# EAGLE design Varella_Aquisition_Module - v.2.0 (EAGLE 9.4.2)
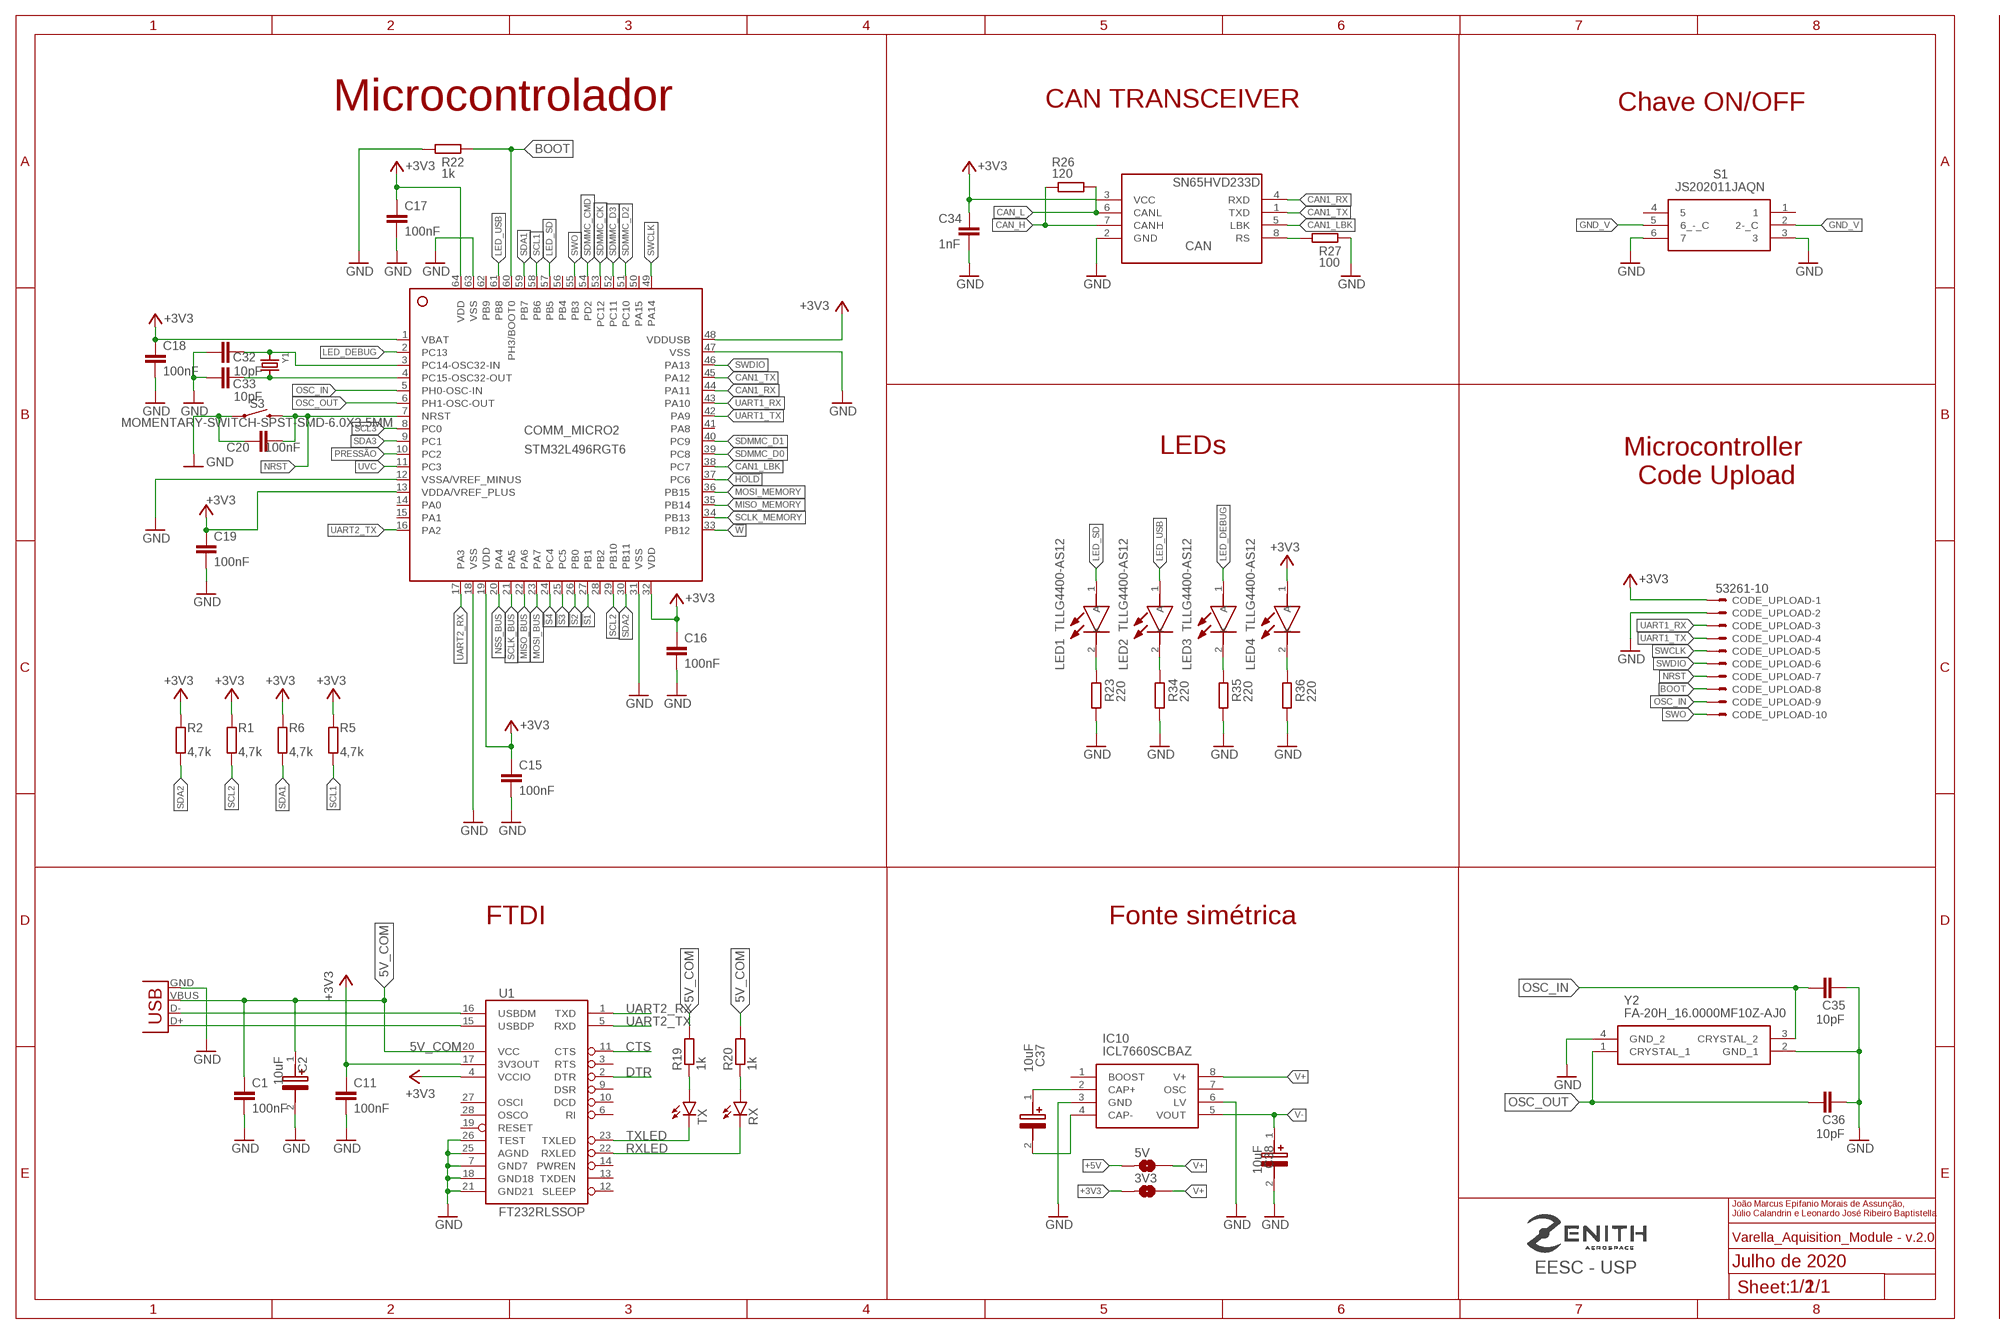
[diagram p0: schematic, sheet 1, part 1 of 2]
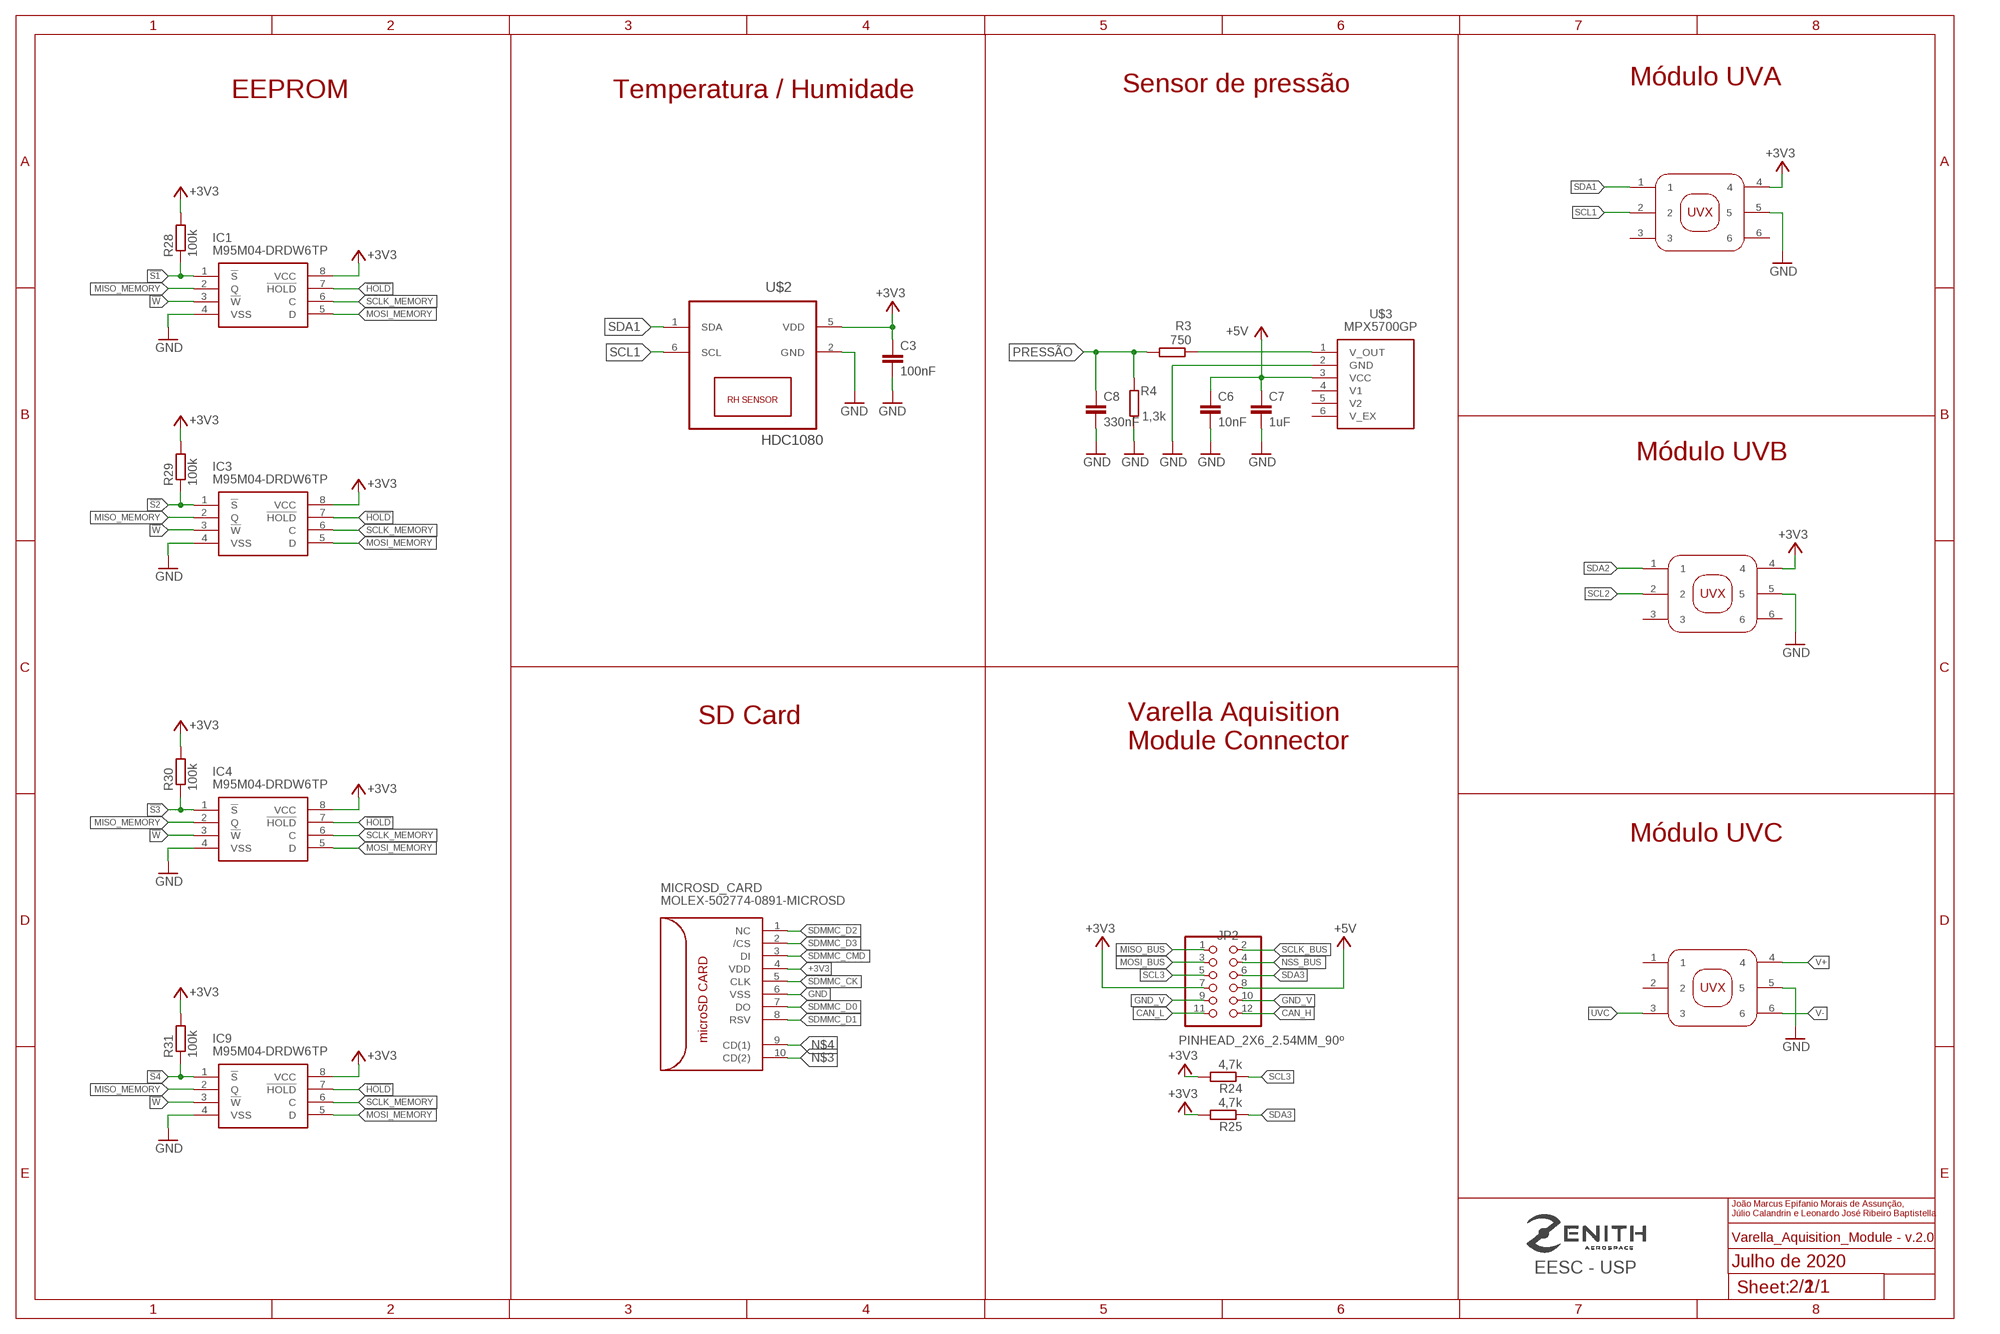
[diagram p1: schematic, sheet 1, part 2 of 2]

## Parts
3V3  SMD-JUMPER-2  [SMD-JUMPER-2]
5V  SMD-JUMPER-2  [SMD-JUMPER-2]
C1  100nF  C-EUC0805  [C0805]
C2  10uF  EEE-FN1A100R  [CAPAE430X610N]
C3  100nF  C-EUC0805  [C0805]
C6  10nF  C-EUC0805  [C0805]
C7  1uF  C-EUC0805  [C0805]
C8  330nF  C-EUC0805  [C0805]
C11  100nF  C-EUC0805  [C0805]
C15  100nF  C-EUC0805  [C0805]
C16  100nF  C-EUC0805  [C0805]
C17  100nF  C-EUC0805  [C0805]
C18  100nF  C-EUC0805  [C0805]
C19  100nF  C-EUC0805  [C0805]
C20  100nF  C-EUC0805  [C0805]
C32  10pF  C-EUC0805  [C0805]
C33  10pF  C-EUC0805  [C0805]
C34  1nF  C-EUC1206  [C1206]
C35  10pF  C-EUC0805  [C0805]
C36  10pF  C-EUC0805  [C0805]
C37  10uF  EEE-FN1A100R  [CAPAE430X610N]
C38  10uF  EEE-FN1A100R  [CAPAE430X610N]
CAN  SN65HVD233D  [SOIC8]
CODE_UPLOAD  53261-10  [53261-10]
COMM_MICRO2  STM32L496RGT6  [LQFP64_10X10]
IC1  M95M04-DRDW6TP  [SOP65P640X120-8N]
IC3  M95M04-DRDW6TP  [SOP65P640X120-8N]
IC4  M95M04-DRDW6TP  [SOP65P640X120-8N]
IC9  M95M04-DRDW6TP  [SOP65P640X120-8N]
IC10  ICL7660SCBAZ  [SOIC127P600X175-8N@1]
JP2  PINHEAD_2X6_2.54MM_90º  [PINHEAD_2X6_2.54MM_90º]
LED1  TLLG4400-AS12  [TLLG4400AS12]
LED2  TLLG4400-AS12  [TLLG4400AS12]
LED3  TLLG4400-AS12  [TLLG4400AS12]
LED4  TLLG4400-AS12  [TLLG4400AS12]
MICROSD_CARD  MOLEX-502774-0891-MICROSD  [MOLEX-502774-0891-MICROSD]
R1  4,7k  R-EU_R0805  [R0805]
R2  4,7k  R-EU_R0805  [R0805]
R3  750  R-EU_R0805  [R0805]
R4  1,3k  R-EU_R0805  [R0805]
R5  4,7k  R-EU_R0805  [R0805]
R6  4,7k  R-EU_R0805  [R0805]
R19  1k  R-EU_R0805  [R0805]
R20  1k  R-EU_R0805  [R0805]
R22  1k  R-EU_R0805  [R0805]
R23  220  R-EU_R0805  [R0805]
R24  4,7k  R-EU_R0805  [R0805]
R25  4,7k  R-EU_R0805  [R0805]
R26  120  R-EU_R1206  [R1206]
R27  100  R-EU_R0805  [R0805]
R28  100k  R-EU_R0805  [R0805]
R29  100k  R-EU_R0805  [R0805]
R30  100k  R-EU_R0805  [R0805]
R31  100k  R-EU_R0805  [R0805]
R34  220  R-EU_R0805  [R0805]
R35  220  R-EU_R0805  [R0805]
R36  220  R-EU_R0805  [R0805]
RX  LEDCHIPLED_0805  [CHIPLED_0805]
S1  JS202011JAQN  [JS202011JAQN]
S3  MOMENTARY-SWITCH-SPST-SMD-6.0X3.5MM  [TACTILE_SWITCH_SMD_6.0X3.5MM]
TX  LEDCHIPLED_0805  [CHIPLED_0805]
U1  FT232RLSSOP  [SSOP28DB]
U$2  HDC1080  [TI-S-PWSON-N6]
U$3  MPX5700GP  [MPX5700GP]
U$6  MODULO_UV  [MODULO_UV]
U$7  MODULO_UV  [MODULO_UV]
U$8  MODULO_UV  [MODULO_UV]
X2  USB-SMD-NS  [USB-MINIB-NOSTOP]
Y1  CRYSTAL8X3.8SMT  [CRYSTAL_8X3.8]
Y2  FA-20H_16.0000MF10Z-AJ0  [FA20H160000MF12ZAC3]

## Nets
5V_COM: C1.1 C2.1(+) R19.2 R20.2 U1.20(VCC) X2.VBUS
!HOLD: COMM_MICRO2.37(PC6) IC1.7(!HOLD) IC3.7(!HOLD) IC4.7(!HOLD) IC9.7(!HOLD)
!S1: COMM_MICRO2.27(PB1) IC1.1(!S) R28.1
!S2: COMM_MICRO2.26(PB0) IC3.1(!S) R29.1
!S3: COMM_MICRO2.25(PC5) IC4.1(!S) R30.1
!S4: COMM_MICRO2.24(PC4) IC9.1(!S) R31.1
!W: COMM_MICRO2.33(PB12) IC1.3(!W) IC3.3(!W) IC4.3(!W) IC9.3(!W)
+3V3: 3V3.2 C3.1 C11.1 C15.1 C16.1 C17.1 C18.1 C19.1 C34.1 CAN.3(VCC) CODE_UPLOAD.1 COMM_MICRO2.1(VBAT) COMM_MICRO2.13(VDDA/VREF_PLUS) COMM_MICRO2.19(VDD) COMM_MICRO2.32(VDD) COMM_MICRO2.48(VDDUSB) COMM_MICRO2.64(VDD) IC1.8(VCC) IC3.8(VCC) IC4.8(VCC) IC9.8(VCC) JP2.7 LED4.1(A) MICROSD_CARD.4(VDD) R1.2 R2.2 R5.2 R6.2 R24.2 R25.2 R28.2 R29.2 R30.2 R31.2 U1.4(VCCIO) U1.17(3V3OUT) U$2.5(VDD) U$6.4 U$7.4
+5V: 5V.2 C6.1 C7.1 JP2.8 U$3.3(VCC)
BOOT: CODE_UPLOAD.8 COMM_MICRO2.60(PH3/BOOT0) R22.1
CAN1_LBK: CAN.5(LBK) COMM_MICRO2.38(PC7)
CAN1_RX: CAN.4(RXD) COMM_MICRO2.44(PA11)
CAN1_TX: CAN.1(TXD) COMM_MICRO2.45(PA12)
CAN_H: CAN.7(CANH) JP2.12 R26.1
CAN_L: CAN.6(CANL) JP2.11 R26.2
CRYSTAL1: C32.2 COMM_MICRO2.3(PC14-OSC32-IN) Y1.P$1
CTS: U1.11(CTS)
DTR: U1.2(DTR)
GND [power]: C1.2 C2.2(-) C3.2 C6.2 C7.2 C8.2 C11.2 C15.2 C16.2 C17.2 C18.2 C19.2 C20.1 C32.1 C33.1 C34.2 C35.2 C36.2 C38.2(-) CAN.2(GND) CODE_UPLOAD.2 COMM_MICRO2.12(VSSA/VREF_MINUS) COMM_MICRO2.18(VSS) COMM_MICRO2.31(VSS) COMM_MICRO2.47(VSS) COMM_MICRO2.63(VSS) IC1.4(VSS) IC3.4(VSS) IC4.4(VSS) IC9.4(VSS) IC10.3(GND) IC10.6(LV) MICROSD_CARD.6(VSS) R4.2 R22.2 R23.1 R27.1 R34.1 R35.1 R36.1 S1.3 S1.6 S3.1 U1.7(GND7) U1.18(GND18) U1.21(GND21) U1.25(AGND) U1.26(TEST) U$2.2(GND) U$6.5 U$7.5 U$8.5 X2.GND Y2.2(GND_1) Y2.4(GND_2)
GND_V: JP2.9 JP2.10 S1.2(2-_C) S1.5(6_-_C)
LED_DEBUG: COMM_MICRO2.2(PC13) LED3.1(A)
LED_SD: COMM_MICRO2.57(PB5) LED1.1(A)
LED_USB: COMM_MICRO2.61(PB8) LED2.1(A)
MISO_BUS: COMM_MICRO2.22(PA6) JP2.1
MISO_MEMORY: COMM_MICRO2.35(PB14) IC1.2(Q) IC3.2(Q) IC4.2(Q) IC9.2(Q)
MOSI_BUS: COMM_MICRO2.23(PA7) JP2.3
MOSI_MEMORY: COMM_MICRO2.36(PB15) IC1.5(D) IC3.5(D) IC4.5(D) IC9.5(D)
N$3: MICROSD_CARD.10(CD(2))
N$4: MICROSD_CARD.9(CD(1))
N$5: U$3.2(GND)
N$6: R3.1 U$3.1(V_OUT)
N$10: C33.2 COMM_MICRO2.4(PC15-OSC32-OUT) Y1.P$4
N$11: CAN.8(RS) R27.2
N$12: C37.1(+) IC10.2(CAP+)
N$13: C37.2(-) IC10.4(CAP-)
N$16: LED1.2(K) R23.2
N$17: LED2.2(K) R34.2
N$19: LED3.2(K) R35.2
N$20: LED4.2(K) R36.2
NRST: C20.2 CODE_UPLOAD.7 COMM_MICRO2.7(NRST) S3.2
NSS_BUS: COMM_MICRO2.20(PA4) JP2.4
OSC_IN: C35.1 CODE_UPLOAD.9 COMM_MICRO2.5(PH0-OSC-IN) Y2.3(CRYSTAL_2)
OSC_OUT: C36.1 COMM_MICRO2.6(PH1-OSC-OUT) Y2.1(CRYSTAL_1)
PRESSÃO: C8.1 COMM_MICRO2.10(PC2) R3.2 R4.1
RXL: R20.1 RX.A
RXLED: RX.C U1.22(RXLED)
SCL1: COMM_MICRO2.58(PB6) R5.1 U$2.6(SCL) U$6.2
SCL2: COMM_MICRO2.29(PB10) R1.1 U$7.2
SCL3: COMM_MICRO2.8(PC0) JP2.5 R24.1
SCLK_BUS: COMM_MICRO2.21(PA5) JP2.2
SCLK_MEMORY: COMM_MICRO2.34(PB13) IC1.6(C) IC3.6(C) IC4.6(C) IC9.6(C)
SDA1: COMM_MICRO2.59(PB7) R6.1 U$2.1(SDA) U$6.1
SDA2: COMM_MICRO2.30(PB11) R2.1 U$7.1
SDA3: COMM_MICRO2.9(PC1) JP2.6 R25.1
SDMMC_CK: COMM_MICRO2.53(PC12) MICROSD_CARD.5(CLK)
SDMMC_CMD: COMM_MICRO2.54(PD2) MICROSD_CARD.3(DI)
SDMMC_D0: COMM_MICRO2.39(PC8) MICROSD_CARD.7(DO)
SDMMC_D1: COMM_MICRO2.40(PC9) MICROSD_CARD.8(RSV)
SDMMC_D2: COMM_MICRO2.51(PC10) MICROSD_CARD.1(NC)
SDMMC_D3: COMM_MICRO2.52(PC11) MICROSD_CARD.2(/CS)
SWCLK: CODE_UPLOAD.5 COMM_MICRO2.49(PA14)
SWDIO: CODE_UPLOAD.6 COMM_MICRO2.46(PA13)
SWO: CODE_UPLOAD.10 COMM_MICRO2.55(PB3)
TXL: R19.1 TX.A
TXLED: TX.C U1.23(TXLED)
UART1_RX: CODE_UPLOAD.3 COMM_MICRO2.43(PA10)
UART1_TX: CODE_UPLOAD.4 COMM_MICRO2.42(PA9)
UART2_RX: COMM_MICRO2.17(PA3) U1.1(TXD)
UART2_TX: COMM_MICRO2.16(PA2) U1.5(RXD)
USB_D+2: U1.15(USBDP) X2.D+
USB_D-2: U1.16(USBDM) X2.D-
UVC: COMM_MICRO2.11(PC3) U$8.3
V+: 3V3.1 5V.1 IC10.8(V+) U$8.4
V-: C38.1(+) IC10.5(VOUT) U$8.6
Unconnected: COMM_MICRO2.14(PA0) COMM_MICRO2.15(PA1) COMM_MICRO2.28(PB2) COMM_MICRO2.41(PA8) COMM_MICRO2.50(PA15) COMM_MICRO2.56(PB4) COMM_MICRO2.62(PB9) IC10.1(BOOST) IC10.7(OSC) S1.1 S1.4 U1.3(RTS) U1.6(RI) U1.9(DSR) U1.10(DCD) U1.12(SLEEP) U1.13(TXDEN) U1.14(PWREN) U1.19(RESET) U1.27(OSCI) U1.28(OSCO) U$3.4(V1) U$3.5(V2) U$3.6(V_EX) U$6.3 U$6.6 U$7.3 U$7.6 U$8.1 U$8.2

## Notes on the sheet
- Sensor de pressão | Módulo UVA
- CAN TRANSCEIVER | EEPROM | Temperatura / Humidade
- Microcontrolador | Chave ON/OFF
- LEDs
- Microcontroller
   Code Upload
- Módulo UVB
- SD Card
- Varella Aquisition 
  Module Connector
- Módulo UVC
- FTDI | Fonte simétrica
- João Marcus Epifanio Morais de Assunção,
  Júlio Calandrin e Leonardo José Ribeiro Baptistella
- João Marcus Epifanio Morais de Assunção,
  Júlio Calandrin e Leonardo José Ribeiro Baptistella
- EESC - USP | Julho de 2020 | EESC - USP | Julho de 2020
- 1/2 | 2/2
- C:/Users/marcu/Desktop/Ensino Superior/Graduação - Eng Elétrica/Zenith/zenith-v2.bmp | C:/Users/marcu/Desktop/Ensino Superior/Graduação - Eng Elétrica/Zenith/zenith-v2.bmp

## Library data of the parts
3V3 5V = FaBo-PIN:SMD-JUMPER-2
C1 C3 C6-C8 C11 C15-C20 C32-C36 = rcl:C-EU: CAPACITOR, European symbol; SPICEPREFIX: C
C2 C37 C38 = SamacSys_Parts:EEE-FN1A100R: Cap Aluminum Lytic 10uF 10V 20% (4 X 5.8mm) SMD 1.35 Ohm 90mA 2000h 105C Automotive T/R Source: Datasheet <https://b2b-api.panasonic.eu/file_stream/pids/fileversion/9127>; DESCRIPTION: Cap Aluminum Lytic 10uF 10V 20% (4 X 5.8mm) SMD 1.35 Ohm 90mA 2000h 105C Automotive T/R; HEIGHT: 6.1mm; MANUFACTURER_NAME: Panasonic; MANUFACTURER_PART_NUMBER: EEE-FN1A100R; MOUSER_PART_NUMBER: 667-EEE-FN1A100R; MOUSER_PRICE-STOCK: https://www.mouser.co.uk/ProductDetail/Panasonic/EEE-FN1A100R?qs=OlC7AqGiEDnwyj8%252BXXw94g%3D%3D
CAN = SN65HVD233D:SN65HVD233D; AVAILABILITY: Unavailable; DESCRIPTION: 3.3V CAN Transceiver with Standby Mode, Loop-back 8-SOIC -40 to 125; MF: Texas Instruments; MP: SN65HVD233D; PACKAGE: SOIC-8 Texas Instruments; PRICE: None
CODE_UPLOAD = con-molex:53?-10: CONNECTOR wire to board 1.25 mm (.049 inch) pitch header; MF: MOLEX; OC_FARNELL: unknown; OC_NEWARK: unknown
COMM_MICRO2 = STM32L4xxx:STM32L496R*: STM32L496RX LQFP64 Cortex M4, 80MHz, 512kB-1024kB Flash, 320kB SRAM Datasheet STM32L496XX <http://www.st.com/content/ccc/resource/technical/document/datasheet/group3/3f/73/19/d1/d4/9e/48/34/DM00284211/files/DM00284211.pdf/jcr:content/translations/en.DM00284211.pdf>; FARNELL: 2725138; FLASH: 1024kB; SRAM: 320kB
IC1 IC3 IC4 IC9 = SamacSys_Parts:M95M04-DRDW6TP: EEPROM 4-Mbit serial SPI bus EEPROM Source: Datasheet <https://componentsearchengine.com/Datasheets/1/M95M04-DRDW6TP.pdf>; DESCRIPTION: EEPROM 4-Mbit serial SPI bus EEPROM; HEIGHT: 1.2mm; MANUFACTURER_NAME: STMicroelectronics; MANUFACTURER_PART_NUMBER: M95M04-DRDW6TP; MOUSER_PART_NUMBER: 511-M95M04-DRDW6TP; MOUSER_PRICE-STOCK: https://www.mouser.co.uk/ProductDetail/STMicroelectronics/M95M04-DRDW6TP?qs=wnTfsH77Xs5ZmZ71YtTm4A%3D%3D
IC10 = SamacSys_Parts:ICL7660SCBAZ: CMOS VOLTAGE CONVERTER Source: Datasheet <http://componentsearchengine.com/Datasheets/3/ICL7660SCBAZ.pdf>; DESCRIPTION: CMOS VOLTAGE CONVERTER; HEIGHT: 1.75mm; MANUFACTURER_NAME: Intersil; MANUFACTURER_PART_NUMBER: ICL7660SCBAZ; MOUSER_PART_NUMBER: 968-ICL7660SCBAZ; MOUSER_PRICE-STOCK: http://www.mouser.com/Search/ProductDetail.aspx?qs=sIflSk8B27a55iJGsgXUkw%3d%3d
JP2 = Pinhead-Zenith:PINHEAD_2X6_2.54MM_90º
LED1-LED4 = SamacSys_Parts:TLLG4400-AS12: Standard LEDs - Through Hole Green; 1.2mcd; 3mm 562-575nm; 1.9V Typ Source: Datasheet <http://www.vishay.com/docs/83029/tllg440.pdf>; DESCRIPTION: Standard LEDs - Through Hole Green; 1.2mcd; 3mm 562-575nm; 1.9V Typ; HEIGHT: 6.1mm; MANUFACTURER_NAME: Vishay; MANUFACTURER_PART_NUMBER: TLLG4400-AS12; MOUSER_PART_NUMBER: 78-TLLG4400-AS12; MOUSER_PRICE-STOCK: https://www.mouser.co.uk/ProductDetail/Vishay-Semiconductors/TLLG4400-AS12?qs=ZTK%252Bjoi3Sg6xGMde4j6A1A%3D%3D
MICROSD_CARD = Ava:MOLEX-502774-0891-MICROSD; FARNELL: 2064063
R1-R6 R19 R20 R22-R31 R34-R36 = rcl:R-EU_: RESISTOR, European symbol; SPICEPREFIX: R
RX TX = led:LED: LED OSRAM: - CHIPLED LG R971, LG N971, LY N971, LG Q971, LY Q971, LO R971, LY R971 LH N974, LH R974 LS Q976, LO Q976, LY Q976 LO Q996 - Hyper CHIPLED LW Q18S LB Q993, LB Q99A, LB R99A - SideLED LS A670, LO A670, LY A670, LG A670, LP A670 LB A673, LV A673, LT A673, LW A673 LH A674 LY A675 LS A676, LA A676, LO A676, LY A676, LW A676 LS A679, LY A679, LG A679 - Hyper Micro SIDELED® LS Y876, LA Y876, LO Y876, LY Y876 LT Y87S - SmartLED LW L88C, LW L88S LB L89C, LB L89S, LG L890 LS L89K, LO L89K, LY L89K LS L896, LA L896, LO L896, LY L896 - TOPLED LS T670, LO T670, LY T670, LG T670, LP T670 LSG T670, LSP T670, LSY T670, LOP T670, LYG T670 LG T671, LOG T671, LSG T671 LB T673, LV T673, LT T673, LW T673 LH T674 LS T676, LA T676, LO T676, LY T676, LB T676, LH T676, LSB T676, LW T676 LB T67C, LV T67C, LT T67C, LS T67K, LO T67K, LY T67K, LW E67C LS E67B, LA E67B, LO E67B, LY E67B, LB E67C, LV E67C, LT E67C LW T67C LS T679, LY T679, LG T679 LS T770, LO T770, LY T770, LG T770, LP T770 LB T773, LV T773, LT T773, LW T773 LH T774 LS E675, LA E675, LY E675, LS T675 LS T776, LA T776, LO T776, LY T776, LB T776 LHGB T686 LT T68C, LB T68C - Hyper Mini TOPLED® LB M676 - Mini TOPLED Santana® LG M470 LS M47K, LO M47K, LY M47K Source: http://www.osram.convergy.de LUXEON: - LUMILED® LXK2-PW12-R00, LXK2-PW12-S00, LXK2-PW14-U00, LXK2-PW14-V00 LXK2-PM12-R00, LXK2-PM12-S00, LXK2-PM14-U00 LXK2-PE12-Q00, LXK2-PE12-R00, LXK2-PE12-S00, LXK2-PE14-T00, LXK2-PE14-U00 LXK2-PB12-K00, LXK2-PB12-L00, LXK2-PB12-M00, LXK2-PB14-N00, LXK2-PB14-P00, LXK2-PB14-Q00 LXK2-PR12-L00, LXK2-PR12-M00, LXK2-PR14-Q00, LXK2-PR14-R00 LXK2-PD12-Q00, LXK2-PD12-R00, LXK2-PD12-S00 LXK2-PH12-R00, LXK2-PH12-S00 LXK2-PL12-P00, LXK2-PL12-Q00, LXK2-PL12-R00 Source: www.luxeon.com KINGBRIGHT: KA-3528ASYC Source: www.kingbright.com
S1 = SamacSys_Parts:JS202011JAQN: JS Series Sub-Miniature Slide Switch Source: Datasheet <https://www.ckswitches.com/media/1422/js.pdf>; DESCRIPTION: JS Series Sub-Miniature Slide Switch; HEIGHT: 3mm; MANUFACTURER_NAME: C & K COMPONENTS; MANUFACTURER_PART_NUMBER: JS202011JAQN; MOUSER_PART_NUMBER: 611-JS202011JAQN; MOUSER_PRICE-STOCK: https://www.mouser.co.uk/ProductDetail/CK/JS202011JAQN?qs=74EMXstkWMXDMLzbTlF50w%3D%3D
S3 = SparkFun-Switches:MOMENTARY-SWITCH-SPST: Momentary Switch (Pushbutton) - SPST Normally-open (NO) SPST momentary switches (buttons, pushbuttons). Variants PTH-12MM - 12mm square, through-hole Momentary Pushbutton Switch - 12mm Square <https://www.sparkfun.com/products/9190> (COM-09190) PTH-6.0MM, PTH-6.0MM-KIT - 6.0mm square, through-hole Mini Pushbutton Switch <https://www.sparkfun.com/products/97> (COM-00097) KIT package intended for soldering kit's - only one side of pads' copper is exposed. PTH-RIGHT-ANGLE-KIT - Right-angle, through-hole Right Angle Tactile Button <https://www.sparkfun.com/products/10791> - Used on SparkFun BigTime Watch Kit <https://www.sparkfun.com/products/11734> SMD-12MM - 12mm square, surface-mount Tactile Button - SMD (12mm) <https://www.sparkfun.com/products/12993> (COM-12993) Used on SparkFun PicoBoard <https://www.sparkfun.com/products/11888> SMD-4.5MM - 4.5mm Square Trackball Switch Used on SparkFun Blackberry Trackballer Breakout <https://www.sparkfun.com/products/13169> SMD-4.6MMX2.8MM - 4.60mm x 2.80mm, surface mount Used on SparkFun SAMD21 Mini Breakout <https://www.sparkfun.com/products/13664> SMD-5.2MM, SMD-5.2-REDUNDANT - 5.2mm square, surface-mount Mini Pushbutton Switch - SMD <https://www.sparkfun.com/products/8720> (COM-08720) Used on Arduino Pro Mini <https://www.sparkfun.com/products/11114> REDUNDANT package connects both switch circuits together SMD-6.0X3.5MM - 6.0 x 3.5mm, surface mount Momentary Reset Switch SMD <https://www.sparkfun.com/products/8229> (COM-08229) SMD-6.2MM-TALL - 6.2mm square, surface mount Tactile Button - SMD (6mm) <https://www.sparkfun.com/products/12992> Used on SparkFun Digital Sandbox <https://www.sparkfun.com/products/12651> SMD-RIGHT-ANGLE - Right-angle, surface mount Used on SparkFun Block for Intel® Edison - Arduino <https://www.sparkfun.com/products/13036>; PROD_ID: SWCH-00815; SF_SKU: COM-08229
U1 = SparkFun:FT232RL: USB UART FT232RL 4th Generation USB UART (USB <-> Serial) Controller. Spark Fun Electronics SKU : COM-00650
U$2 = Texas-HDC1080:HDC1080
U$3 = MPX5700:MPX5700GP
U$6-U$8 = Zenith_Breakouts:MODULO_UV
X2 = SparkFun:USB: USB Connectors USB-B-PTH is fully proven SKU : PRT-00139 USB-miniB is fully proven SKU : PRT-00587 USB-A-PCB is untested. USB-A-H is throughly reviewed, but untested. Spark Fun Electronics SKU : PRT-00437 USB-B-SMT is throughly reviewed, but untested. Needs silkscreen touching up. USB-A-S has not been used/tested USB-MB-H has not been used/tested
Y1 = microbuilder:CRYSTAL: Crystals HC49UP - Surface Mount Crystal 4.0MHz 18pF +/-30ppm Surface Mount Crystal [Digikey: 535-9857-1-ND] 12.0 MHz Surface Mount Crystal [Digikey: 535-9869-6-ND] 25.0 MHz Surface Mount Crystal [Digikey: 535-9078-1-ND] 2.5 x 2.0mm - MEMs SMT Crystal 16.0 MHz 10pF 20ppm 2.5 x 2.0mm Crystal [Digikey -40-85°C: 535-10923-1-ND] 3.2 x 2.5mm - MEMs SMT Crystal 12.0 MHz 8pF 15ppm 3.2 x 2.5mm Crystal [Digikey: -10-70°C: 644-1047-1-ND -40-125°C: 644-1128-1-ND] 16.0 MHz 8pF 15ppm 3.2 x 2.5mm Crystal [Digikey: -10-70°C: 644-1049-1-ND -40-125°C: 644-1129-2-ND] 16.0 MHz 10pF 10ppm 3.2 x 2.5mm Crystal [Digikey: 644-1100-1-ND] 27.12 MHz 18pF 30ppm 3.2 x 2.5mm Crystal [Digikey: 887-1424-1-ND] 27.12MHz 10pF 10ppm 3.2 x 2.5mm Crystal [Digikey: 887-1329-1-ND] 4.9 x 1.8mm - MEMs SMT Crystal 32.768 KHz 12.5pF 20ppm 4.9 x 1.8mm Crystal [Digikey: SE2415CT-ND] 8.0 x 3.8mm - Surface Mount Crystal 32.768kHz 12.5pF 20ppm -40°C-85°C [Digikey: 535-9166-2-ND] Cylinder 32.768KHz Cylinder Crystal (2x6mm body) [Ex. Digikey: 300-8341-2-ND]
Y2 = SamacSys_Parts:FA-20H_16.0000MF10Z-AJ0: Source: Datasheet <https://support.epson.biz/td/api/doc_check.php?dl=brief_FA-20H&lang=en>; HEIGHT: 0.55mm; MANUFACTURER_NAME: Epson Timing; MANUFACTURER_PART_NUMBER: FA-20H 16.0000MF10Z-AJ0; MOUSER_PART_NUMBER: 732-FA-20H16MF10ZAJ0; MOUSER_PRICE-STOCK: https://www.mouser.co.uk/ProductDetail/Epson-Timing/FA-20H-160000MF10Z-AJ0?qs=f9yNj16SXrIaU%252BY5GFRuIg%3D%3D

## Net classes
1 power: width 0.254 mm

## Board
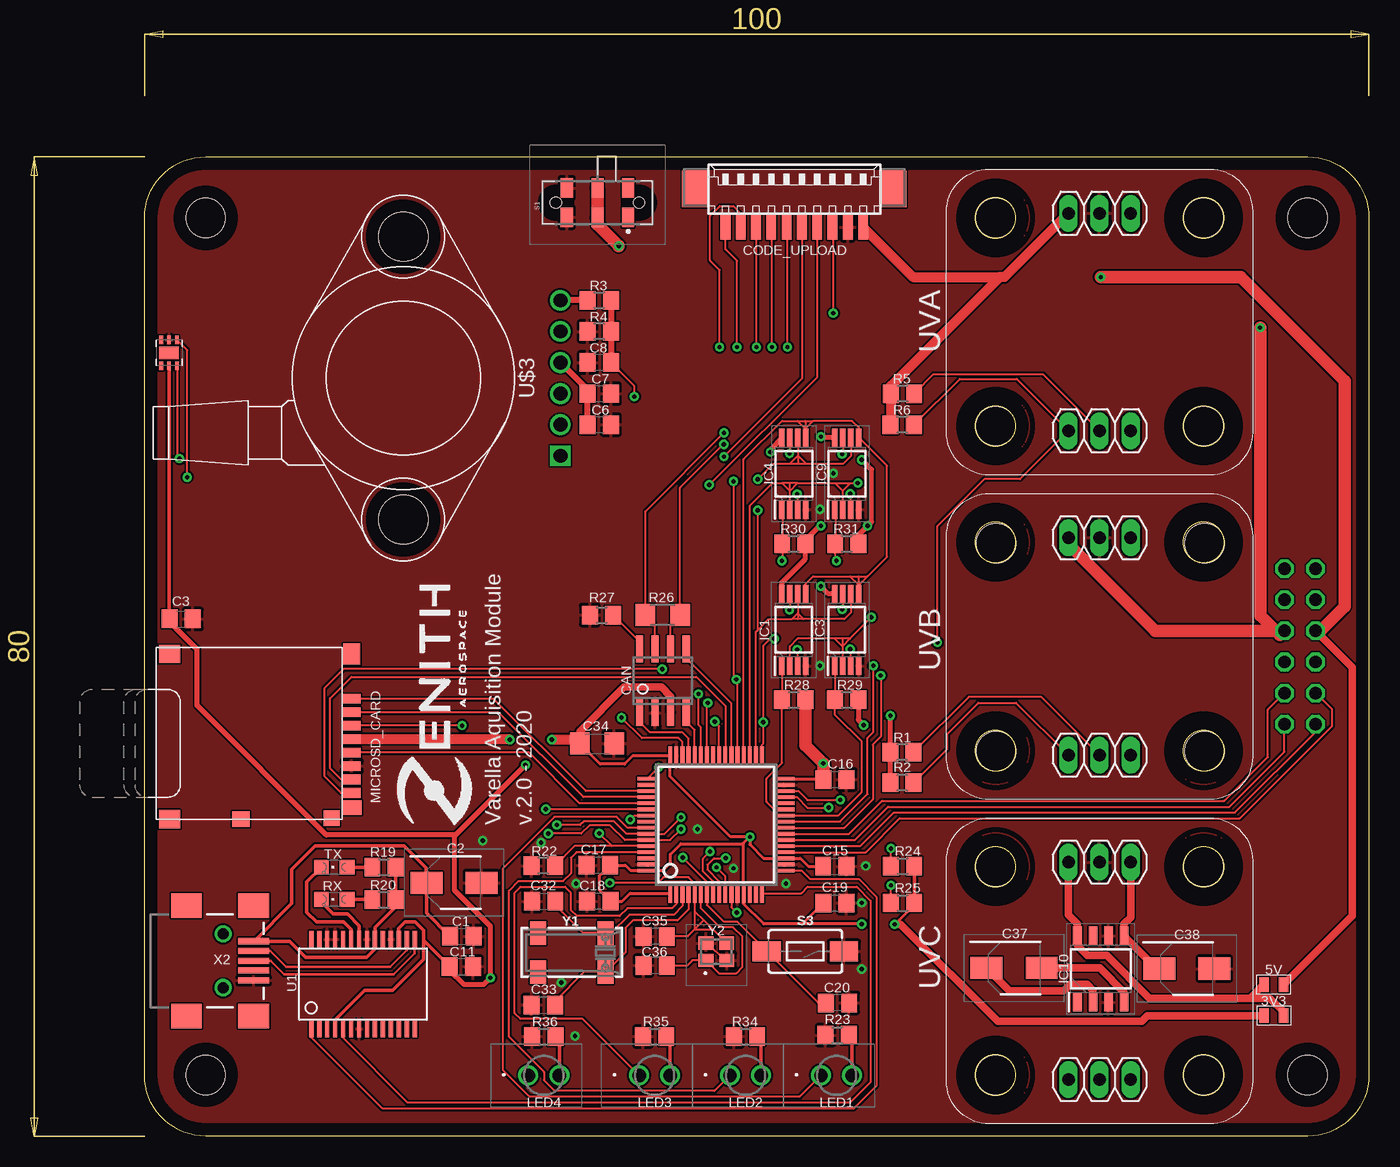
[diagram p2: board, top side]
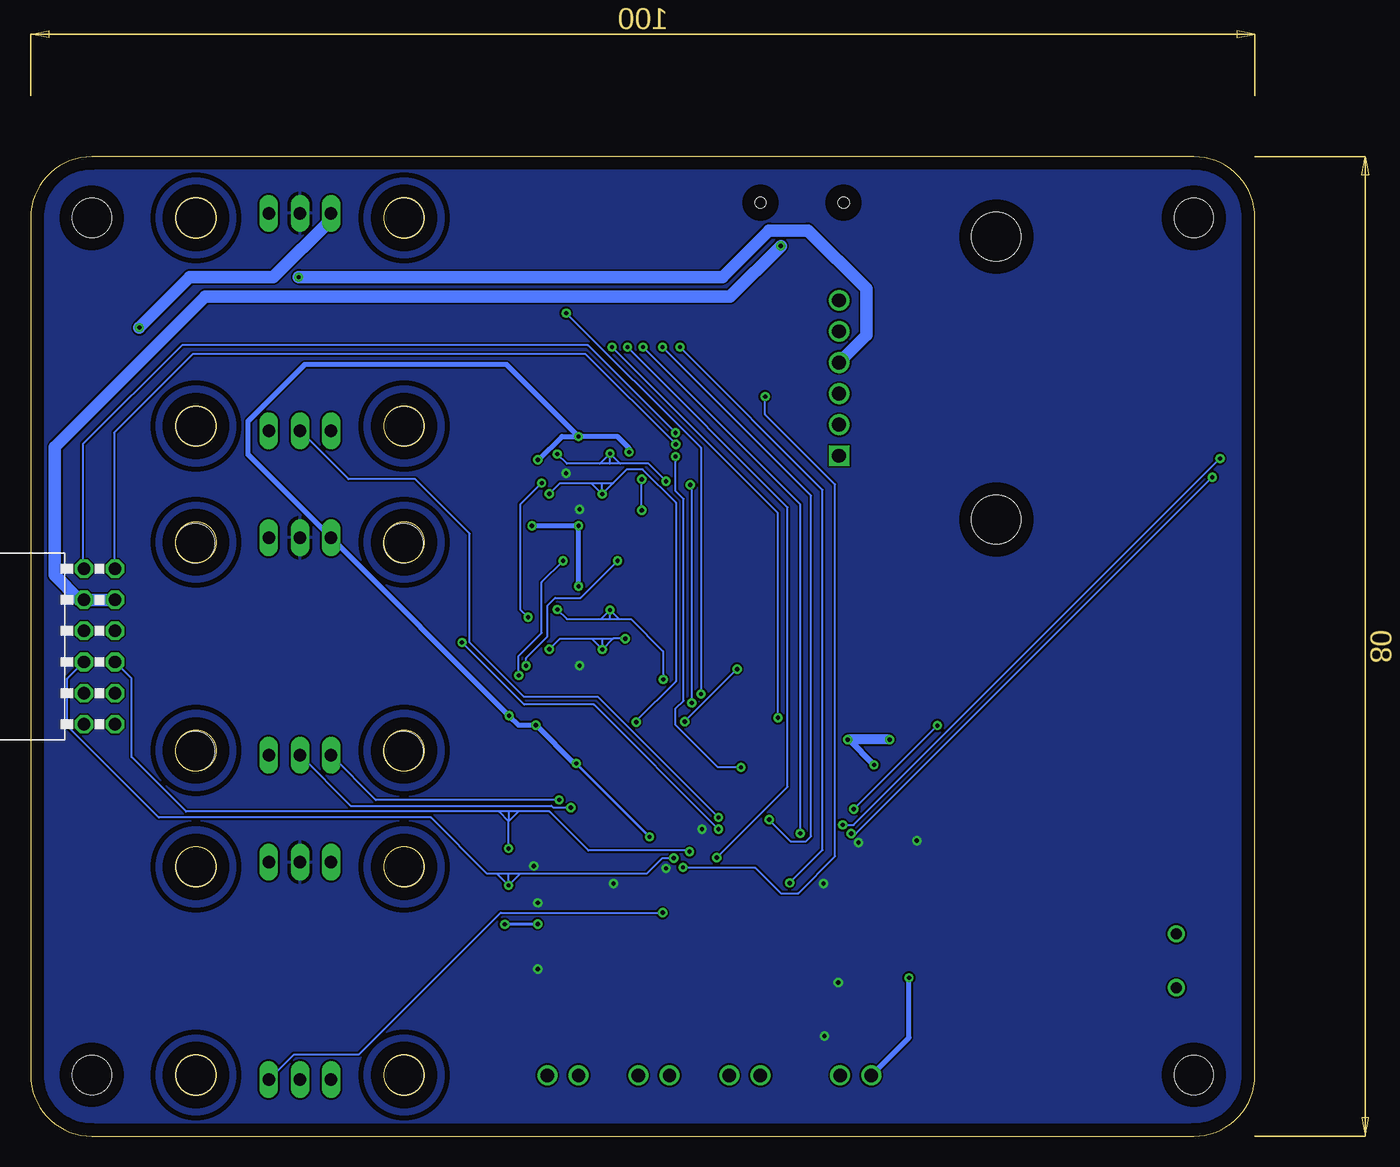
[diagram p3: board, bottom side, seen from below]

Size 100 x 80 mm. Coordinates in mm from the lower left corner, seen from the top.
Outline: 5,80 95,80 arc-90 100,75 100,5 arc-90 95,0 5,0 arc-90 0,5 0,75 arc-90 5,80
Copper layers (1*16): Top 0.035mm / dielectric 1.5mm / Bottom 0.035mm
Design rules "default": minimum track width 6mil, minimum drill 0.35mm, track to track 6mil, track to pad 6mil, pad to pad 6mil, via to via 6mil, smd to smd 6mil, copper to edge 40mil, drill to drill 6mil, minimum pad ring 10mil, minimum via ring 8mil, stop-mask expansion 4mil, vias tented up to drill 0mil, thermal gap 10mil
Holes 3.2 mm at 5,5 95,5 95,75 5,75 69.5,75 86.5,75 86.5,58 69.5,58 69.5,5 86.5,5 86.5,22 69.5,22 69.56,31.44 86.56,31.44 69.56,48.44 86.56,48.44

### Footprints (pad centres in the part's own frame; a part is rotated, then mirrored left to right if it is on the bottom)
SMD-JUMPER-2 = smd 0.8 x 1.2: 1 -0.8,0; 2 0.8,0
C0805 = smd 1.3 x 1.5: 1 -0.95,0; 2 0.95,0
CAPAE430X610N = smd 2.6 x 1.8: 1 -2.25,0; 2 2.25,0
C1206 = smd 1.6 x 1.8: 1 -1.4,0; 2 1.4,0
SOIC8 = smd 0.6 x 2.2: 1 -1.905,-2.6; 2 -0.635,-2.6; 3 0.635,-2.6; 4 1.905,-2.6; 5 1.905,2.6; 6 0.635,2.6; 7 -0.635,2.6; 8 -1.905,2.6
53261-10 = smd 0.8 x 2: 1 5.625,-2.5; 2 4.375,-2.5; 3 3.125,-2.5; 4 1.875,-2.5; 5 0.625,-2.5; 6 -0.625,-2.5; 7 -1.875,-2.5; 8 -3.125,-2.5; 9 -4.375,-2.5; 10 -5.625,-2.5 | smd 2.1 x 3: S1 8.125,0.625; S2 -8.125,0.625
LQFP64_10X10 = smd 0.3 x 1.6: 1 -3.75,-5.6; 2 -3.25,-5.6; 3 -2.75,-5.6; 4 -2.25,-5.6; 5 -1.75,-5.6; 6 -1.25,-5.6; 7 -0.75,-5.6; 8 -0.25,-5.6; 9 0.25,-5.6; 10 0.75,-5.6; 11 1.25,-5.6; 12 1.75,-5.6; 13 2.25,-5.6; 14 2.75,-5.6; 15 3.25,-5.6; 16 3.75,-5.6; 33 3.75,5.6; 34 3.25,5.6; 35 2.75,5.6; 36 2.25,5.6; 37 1.75,5.6; 38 1.25,5.6; 39 0.75,5.6; 40 0.25,5.6; 41 -0.25,5.6; 42 -0.75,5.6; 43 -1.25,5.6; 44 -1.75,5.6; 45 -2.25,5.6; 46 -2.75,5.6; 47 -3.25,5.6; 48 -3.75,5.6 | smd 1.6 x 0.3: 17 5.6,-3.75; 18 5.6,-3.25; 19 5.6,-2.75; 20 5.6,-2.25; 21 5.6,-1.75; 22 5.6,-1.25; 23 5.6,-0.75; 24 5.6,-0.25; 25 5.6,0.25; 26 5.6,0.75; 27 5.6,1.25; 28 5.6,1.75; 29 5.6,2.25; 30 5.6,2.75; 31 5.6,3.25; 32 5.6,3.75; 49 -5.6,3.75; 50 -5.6,3.25; 51 -5.6,2.75; 52 -5.6,2.25; 53 -5.6,1.75; 54 -5.6,1.25; 55 -5.6,0.75; 56 -5.6,0.25; 57 -5.6,-0.25; 58 -5.6,-0.75; 59 -5.6,-1.25; 60 -5.6,-1.75; 61 -5.6,-2.25; 62 -5.6,-2.75; 63 -5.6,-3.25; 64 -5.6,-3.75
SOP65P640X120-8N = smd 1.475 x 0.45: 1 -2.938,0.975; 2 -2.938,0.325; 3 -2.938,-0.325; 4 -2.938,-0.975; 5 2.938,-0.975; 6 2.938,-0.325; 7 2.938,0.325; 8 2.938,0.975
SOIC127P600X175-8N@1 = smd 1.525 x 0.7: 1 -2.712,1.905; 2 -2.712,0.635; 3 -2.712,-0.635; 4 -2.712,-1.905; 5 2.712,-1.905; 6 2.712,-0.635; 7 2.712,0.635; 8 2.712,1.905
PINHEAD_2X6_2.54MM_90º = drill 1.016 octagon: 1 0,0.04; 2 0,2.58; 3 2.54,0.04; 4 2.54,2.58; 5 5.08,0.04; 6 5.08,2.58; 7 7.62,0.04; 8 7.62,2.58; 9 10.16,0.04; 10 10.16,2.58; 11 12.7,0.04; 12 12.7,2.58
TLLG4400AS12 = drill 1.09 pad 1.635: 1 0,0; 2 2.54,0
MOLEX-502774-0891-MICROSD = smd 0.8 x 1.5: 1 -3.3,8.2; 2 -2.2,8.2; 3 -1.1,8.2; 4 0,8.2; 5 1.1,8.2; 6 2.2,8.2; 7 3.3,8.2; 8 4.4,8.2 | smd 1.29 x 1.3: 9 6.455,6.55 | smd 1.29 x 1.4: 10 6.54,-0.85 | smd 1.5 x 1.7: 11 6.54,-6.65; 12 -6.96,-6.65 | smd 1.7 x 1.4: 14 -6.96,8.2 | smd 1.2 x 1.6: 15 5.6,8.2
R0805 = smd 1.3 x 1.5: 1 -0.95,0; 2 0.95,0
R1206 = smd 1.6 x 1.803: 1 -1.422,0; 2 1.422,0
CHIPLED_0805 = smd 1.2 x 1.2: A 0,-1.05; C 0,1.05
JS202011JAQN = smd 1 x 1.6: 1 -2.5,2.95; 2 0,2.95; 3 2.5,2.95; 4 -2.5,0.55; 5 0,0.55; 6 2.5,0.55 | hole 0.9: -3.4,1.75; 3.4,1.75
TACTILE_SWITCH_SMD_6.0X3.5MM = smd 2.3 x 1.6: 1 -3.15,0; 2 3.15,0
SSOP28DB = smd 0.348 x 1.397: 1 -4.225,-3.656; 2 -3.575,-3.656; 3 -2.925,-3.656; 4 -2.275,-3.656; 5 -1.625,-3.656; 6 -0.975,-3.656; 7 -0.325,-3.656; 8 0.325,-3.656; 9 0.975,-3.656; 10 1.625,-3.656; 11 2.275,-3.656; 12 2.925,-3.656; 13 3.575,-3.656; 14 4.225,-3.656; 15 4.225,3.656; 16 3.575,3.656; 17 2.925,3.656; 18 2.275,3.656; 19 1.625,3.656; 20 0.975,3.656; 21 0.325,3.656; 22 -0.325,3.656; 23 -0.975,3.656; 24 -1.625,3.656; 25 -2.275,3.656; 26 -2.925,3.656; 27 -3.575,3.656; 28 -4.225,3.656
TI-S-PWSON-N6 = smd 0.3 x 0.7: 1 -0.65,-1.05; 2 0,-1.05; 3 0.65,-1.05; 4 0.65,1.05; 5 0,1.05; 6 -0.65,1.05 | smd 1.6 x 1: 7 0,0
MPX5700GP = drill 1.13 pad 1.695: 1 12.7,0; 2 10.16,0; 3 7.62,0; 4 5.08,0; 5 2.54,0 | drill 1.13 pad 1.695 square: 6 0,0 | hole 4: -5.205,12.83; 17.9,12.83
MODULO_UV = drill 1.016 long: 1 9.96,-21.38; 2 12.5,-21.38; 3 15.04,-21.38; 4 9.96,-3.62; 5 12.5,-3.62; 6 15.04,-3.62
USB-MINIB-NOSTOP = smd 2.5 x 0.5: D+ 2.5,0; D- 2.5,0.8; GND 2.5,-1.6; ID 2.5,-0.8; VBUS 2.5,1.6 | smd 2.5 x 2: G1 -3,-4.5; G2 -3,4.5; G3 2.5,4.5; G4 2.5,-4.5 | drill 0.9 pad 0.8: H1 0,2.2 | drill 0.9 pad 0.787: H2 0,-2.2
CRYSTAL_8X3.8 = smd 1.3 x 1.9: P$1 -2.75,-1.6; P$2 2.75,-1.6; P$3 2.75,1.6; P$4 -2.75,1.6
FA20H160000MF12ZAC3 = smd 1.2 x 1.1: 1 -0.85,-0.7; 2 0.85,-0.7; 3 0.85,0.7; 4 -0.85,0.7

### Placement (x,y rotation side)
3V3  92.23,9.84 180 top
5V  92.23,12.38 0 top
C1  25.91,16.33 0 top
C2  25.28,20.7 0 top
C3  3,42.25 0 top
C6  37.14,58.11 0 top
C7  37.14,60.65 0 top
C8  37.14,63.19 180 top
C11  25.88,13.85 0 top
C15  56.38,22.04 0 top
C16  56.39,29.13 0 top
C17  37.06,22.13 180 top
C18  37.1,19.18 180 top
C19  56.4,19.05 0 top
C20  56.6,10.88 180 top
C32  32.6,19.19 0 top
C33  32.57,10.71 0 top
C34  36.96,32.06 0 top
C35  41.71,16.31 180 top
C36  41.71,13.94 180 top
C37  71.02,13.74 0 top
C38  85.12,13.69 0 top
CAN  42.33,37.19 0 top
CODE_UPLOAD  53.07,76.73 0 top
COMM_MICRO2  46.69,25.44 0 top
IC1  53.03,41.36 90 top
IC3  57.36,41.36 90 top
IC4  53.04,54.1 90 top
IC9  57.37,54.1 90 top
IC10  78.1,13.66 90 top
JP2  93.07,33.65 90 bottom
LED1  55.25,4.96 0 top
LED2  47.82,4.96 0 top
LED3  40.4,4.96 0 top
LED4  31.34,4.96 0 top
MICROSD_CARD  8.72,32.43 270 top
R1  61.87,31.36 180 top
R2  61.87,28.86 180 top
R3  37.14,68.27 0 top
R4  37.14,65.73 180 top
R5  61.91,60.64 180 top
R6  61.89,58.1 180 top
R19  19.56,21.98 0 top
R20  19.56,19.32 0 top
R22  32.57,22.1 180 top
R23  56.58,8.26 0 top
R24  61.91,22.07 0 top
R25  61.91,19.05 0 top
R26  42.33,42.56 0 top
R27  37.33,42.56 0 top
R28  53.03,35.64 0 top
R29  57.36,35.64 0 top
R30  53.04,48.39 0 top
R31  57.37,48.39 0 top
R34  49.09,8.14 0 top
R35  41.67,8.14 0 top
R36  32.61,8.14 0 top
RX  15.5,19.34 90 top
S1  37,78 180 top
S3  53.97,15.09 180 top
TX  15.5,21.97 90 top
U1  17.85,12.43 0 top
U$2  2.01,63.98 180 top
U$3  33.97,55.57 90 top
U$6  65.5,79 0 top
U$7  65.5,52.5 0 top
U$8  65.5,26 0 top
X2  6.42,14.33 0 top
Y1  34.9,15 180 top
Y2  46.71,15.06 0 top

### Tracks (layer width: path | path; a pad name or v marks a point on that pad's centre or on a via)
5V_COM
  Top 0.305: R19.2 R20.2 20.52,18.75 18.82,17.06 U1.20 18.82,15.3 18.14,14.62 13.15,14.62 11.84,15.93 X2.VBUS 8.94,15.93 12.01,19 12.01,21.8 13.92,23.71 21.21,23.71 23.02,21.9 23.02,20.71 C2.1 23.03,18.23 24.93,16.33 C1.1
!HOLD  (via drill 0.35)
  Top 0.152: COMM_MICRO2.37 48.44,37.2 v48.33,37.31 48.1,37.54 v48.1,53.5 | 52.7,44.77 IC1.7 52.7,42.97 v52.67,42.97 | IC4.7 52.71,55.79 v52.67,55.75 | IC9.7 57.04,55.77 v56.99,55.72 | IC3.7 57.03,43.06 v56.99,43.02
  Bottom 0.152: v56.99,55.72 56.2,54.93 53.5,54.93 | 51.85,54.93 52.7,54.93 | 52.7,54.93 53.5,54.93 | v52.67,55.75 51.85,54.93 | v52.67,55.75 53.5,54.93 | v52.67,55.75 52.7,55.72 52.7,54.93 | v52.67,42.97 51.93,42.23 | 51.93,42.23 50.96,42.23 48.33,39.6 v48.33,37.31 | v56.99,43.02 56.2,42.23 53.42,42.23 | 53.42,42.23 52.7,42.23 | 52.7,42.23 51.93,42.23 | v52.67,42.97 53.42,42.23 | v52.67,42.97 52.7,42.94 52.7,42.23 | v48.1,53.5 49.53,54.93 51.85,54.93
!S1
  Top 0.152: IC1.1 52.08,38.39 R28.1 52.08,30.49 50.8,29.21 50.8,27.3 51.41,26.69 COMM_MICRO2.27
!S2
  Top 0.152: IC3.1 56.41,38.39 R29.1 56.41,34.4 58.58,32.23 58.58,28.1 56.67,26.19 COMM_MICRO2.26
!S3  (via drill 0.35)
  Top 0.152: IC4.1 52.09,51.14 R30.1 52.09,47.01 v52.07,46.99 | COMM_MICRO2.25 56.81,25.69 59.06,27.94 59.06,32.53 59.53,33 v59.53,38.42
  Bottom 0.152: v59.53,38.42 59.53,39.05 57.78,40.8 57.78,43.34 57.15,43.97 55.09,43.97 v52.07,46.99
!S4  (via drill 0.35)
  Top 0.152: IC9.1 56.42,51.14 R31.1 56.42,47.09 v56.52,46.99 | COMM_MICRO2.24 57.15,25.19 59.48,27.52 59.48,31.98 60.14,32.64 v60.14,37.62
  Bottom 0.152: v60.14,37.62 60.17,37.65 60.17,39.21 58.26,41.12 58.26,45.24 v56.52,46.99
!W  (via drill 0.35)
  Top 0.152: 53.35,51.17 IC4.3 53.36,52.41 v53.32,52.45 | IC9.3 57.69,52.42 v57.65,52.47 | IC1.3 53.35,39.71 v53.31,39.76 | IC3.3 57.68,39.72 v57.64,39.77 | v51.44,40.64 51.12,40.64 50.54,40.07 v50.54,33.81 50.54,32.07 50.44,31.96 COMM_MICRO2.33
  Bottom 0.152: v53.32,52.45 52.42,53.34 | v53.32,52.45 54.21,53.34 | v57.65,52.47 56.77,53.34 54.21,53.34 | 54.21,53.34 53.34,53.34 | 53.34,53.34 52.42,53.34 | v53.32,52.45 53.32,53.32 53.34,53.34 | 52.42,40.64 v53.31,39.76 | v57.64,39.77 56.77,40.64 54.19,40.64 | 54.19,40.64 53.34,40.64 53.31,40.61 | v53.31,39.76 54.19,40.64 | v53.31,39.76 53.31,40.61 | 53.31,40.61 53.28,40.64 52.42,40.64 | v51.44,40.64 52.42,40.64 | v50.54,33.81 50.54,33.91 47.31,37.15 47.31,51.75 50.01,54.45 51.31,54.45 52.42,53.34
+3V3  (via drill 0.35)
  Top 0.152: 55.32,22.04 C15.1 | 55.37,29.19 C16.1 | 35.56,31.66 C34.1 | COMM_MICRO2.64 41.6,21.69
  Top 0.254: COMM_MICRO2.32 55.37,29.19 | 55.32,22.04 54.21,22.04 53.56,22.69 COMM_MICRO2.19 50.57,22.69 49.45,23.81 v49.45,24.45 | COMM_MICRO2.1 39.66,19.84 39.01,19.18 C18.1 37.15,20.09 37.15,21.27 C17.1 39.28,22.13 39.71,21.69 COMM_MICRO2.64 42.33,21.69 42.94,22.3 42.94,23.02 43.81,23.89 48.9,23.89 48.94,23.93 | 48.94,23.93 COMM_MICRO2.13 48.94,18.98 50.59,17.33 53.73,17.33 | 48.94,23.93 v49.45,24.45 | v49.45,24.45 47.86,24.45 42.94,29.37 COMM_MICRO2.48 39.85,31.04 39.21,30.4 37.22,30.4 C34.1 | v58.58,17.33 53.73,17.33 | 62.86,18.89 v61.28,17.31 | C19.1 53.73,17.33
  Top 0.305: U1.17 20.77,16.99 21.29,17.5 22.11,17.5 22.8,16.81 22.8,15.92 | 22.8,15.92 22.8,14.46 20.26,11.92 17.98,11.92 15.57,9.52 U1.4 | C11.1 22.86,15.92 22.8,15.92 | U$2.5 2.01,42.29 C3.1 | 62.86,18.89 R25.2 R24.2 | v61.28,17.3 v61.28,17.31
  Top 0.406: IC9.8 55.35,57.04 v55.24,57.15 | IC4.8 51.12,56.1 v51.12,55.88 | v55.24,49.85 55.13,49.85 53.99,48.7 R30.2 53.98,48.4 53.98,47.15 52.05,45.23 IC1.8 | R31.2 58.32,48.7 58.26,48.65 58.26,49.05 v59.05,49.85 59.37,50.16 59.37,54.45 v58.58,55.24 | IC3.8 55.88,44.29 v55.24,44.93 | R29.2 58.31,34.01 v58.74,33.58 | C11.1 24.93,13.56 26.11,12.38 27.7,12.38 v28.26,12.94 28.26,17.14 25.32,20.08 25.32,24.53 | v31.11,30.32 25.32,24.53 | 25.32,24.53 25.32,24.61 14.84,24.61 4.29,35.16 4.29,39.77 2.01,42.05 2.01,42.29 | R2.2 R1.2 v60.91,34.34 v60.92,34.34
  Top 0.61: CAN.3 42.97,35.93 42.21,36.69 39.18,36.69 35.56,33.06 C34.1 | 3V3.2 81.92,9.84 81.44,9.37 69.69,9.37 61.76,17.3 v61.28,17.3
  Top 0.813: CODE_UPLOAD.1 62.76,70.17 69.85,70.17 | MICROSD_CARD.4 29.8,32.43 v29.84,32.38 | v33.26,32.38 35.23,32.38 C34.1 | 69.85,70.17 60.96,61.28 R5.2 60.96,58.13 R6.2 | U$6.4 70.25,70.17 69.85,70.17
  Top 1.016: v91.12,66.04 91.12,42.55 92.73,40.93 JP2.7 82.56,41.27 75.46,48.37 U$7.4 | R28.2 53.98,31.91 v55.44,30.45 C16.1
  Bottom 0.254: v55.44,30.45 v49.45,24.46 v49.45,24.45 | 58.61,17.3 v61.28,17.3
  Bottom 0.305: v58.58,17.33 58.61,17.3
  Bottom 0.406: v51.12,55.88 51.12,56.2 52.07,57.15 v55.24,57.15 | v55.24,57.15 61.12,63.02 77.63,63.02 82.23,58.42 82.23,55.65 U$7.4 v60.92,34.34 60.16,33.58 v58.74,33.58 55.61,30.45 v55.44,30.45 | v59.05,49.85 v55.24,49.85 v55.24,44.93 | v58.58,55.24 58.51,55.24 56.6,57.15 v55.24,57.15 | LED4.1 28.26,8.05 v28.26,12.94
  Bottom 0.508: v31.11,30.32 33.18,32.38 v33.26,32.38
  Bottom 0.813: v29.84,32.38 v33.26,32.38
  Bottom 1.016: v91.12,66.04 87,70.17 80.17,70.17 75.46,74.88 U$6.4
+5V  (via drill 0.35)
  Top 0.508: 36.19,60.34 C7.1 | C7.1 36.19,60.97 U$3.3 | C6.1 C7.1
  Top 0.61: JP2.8 98.63,38.29 98.64,38.26 98.64,17.99 5V.2
  Top 1.016: JP2.8 96.04,41.27 98.03,43.28 98.03,61.67 89.53,70.17 v78.11,70.17
  Bottom 1.016: U$3.3 31.75,65.41 31.75,69.22 36.51,73.98 39.69,73.98 43.5,70.17 v78.11,70.17
BOOT  (via drill 0.35)
  Top 0.152: COMM_MICRO2.60 38.17,23.69 | 38.17,23.69 35.11,23.69 R22.1 33.52,22.14 | v37.14,24.73 38.17,23.69 | v49.98,64.45 49.98,74.2 CODE_UPLOAD.8
  Bottom 0.152: v37.14,24.73 37.14,51.6 v49.98,64.45
CAN1_LBK
  Top 0.152: COMM_MICRO2.38 47.94,35.33 44.21,39.06 44.21,39.76 CAN.5
CAN1_RX
  Top 0.152: 44.94,31.84 COMM_MICRO2.44 | 44.94,31.83 COMM_MICRO2.44 | CAN.4 44.24,33.88 44.94,33.18 COMM_MICRO2.44
CAN1_TX
  Top 0.152: CAN.1 40.43,33.85 41.26,33.02 43.89,33.02 44.44,32.47 COMM_MICRO2.45
CAN_H  (via drill 0.35)
  Top 0.152: R26.1 41.7,41.78 CAN.7 | R26.1 41.07,42.56 | R26.1 40.91,51.03 v47.33,57.45
  Bottom 0.152: v47.33,57.45 54.49,64.61 87.63,64.61 95.73,56.52 95.73,46.27 JP2.12
CAN_L  (via drill 0.35)
  Top 0.152: R26.2 42.97,41.78 CAN.6 | R26.2 43.82,42.56 | R26.2 43.76,52.96 v47.31,56.52
  Bottom 0.152: v47.31,56.52 54.69,63.9 86.76,63.9 93.19,57.47 93.19,46.27 JP2.11
CRYSTAL1
  Top 0.152: 43.94,19.07 COMM_MICRO2.3 43.94,18.79 43.23,18.09 39.61,18.09 38.12,16.6 Y1.P$1 35.83,16.6 33.55,18.87 C32.2
GND  (via drill 0.35)
  Top 0.152: 47.4,14.36 46,15.76 Y2.4
  Top 0.254: Y2.2 47.4,14.36
  other vias: 32.38,23.97 35.24,20.64 27.62,24.13 48.1,21.88 35.16,8.18 34.05,12.54 55.17,38.42 55.17,51.2 52.39,20.64 56.28,54.13 45.16,25.08 58.58,19.05 58.9,22.07 58.58,13.65
  pour Top: 95,0 5,0 arc-90 0,5 0,75 arc-90 5,80 95,80 arc-90 100.32,74.68 100.32,5.32 arc-90
  pour Bottom: 95,0 5,0 arc-90 0,5 0,75 arc-90 5,80 95,80 arc-90 100.32,74.68 100.32,5.32 arc-90
GND_V  (via drill 0.35)
  Top 1.016: S1.5 S1.2 37,74.47 38.73,72.73 v38.73,72.71
  Bottom 1.016: v38.73,72.71 42.86,68.58 85.72,68.58 98.03,56.28 98.03,45.82 96.04,43.81 JP2.10 JP2.9
LED_DEBUG
  Top 0.152: COMM_MICRO2.2 43.44,18.96 43.09,18.62 39.44,18.62 38.8,17.98 35.31,17.98 34.84,18.46 34.84,19.89 34.36,20.36 30.71,20.36 30.23,19.89 30.23,10.04 30.71,9.57 35.79,9.57 LED3.1
LED_SD
  Top 0.152: LED1.1 53.51,3.22 31.46,3.22 29.28,5.4 29.28,21.87 33.49,26.08 38.57,26.08 39.45,25.19 COMM_MICRO2.57
LED_USB
  Top 0.152: COMM_MICRO2.61 35.28,23.19 34.84,22.74 34.84,21.47 34.2,20.84 30.55,20.84 29.76,20.05 29.76,8.12 32.62,5.26 32.62,4.57 33.5,3.69 46.55,3.69 LED2.1
MISO_BUS
  Top 0.152: COMM_MICRO2.22 58.01,24.19 60.72,26.91 88.62,26.91 93.11,31.4 JP2.1
MISO_MEMORY  (via drill 0.35)
  Top 0.152: IC9.2 57.04,52.68 | 52.07,53.34 52.71,52.7 | IC4.2 52.71,52.7 | 52.71,52.7 53.34,53.33 | 53.34,53.33 53.34,53.34 56.38,53.34 | 56.38,53.34 57.04,52.68 | 53.34,53.33 53.33,53.34 52.7,53.34 | 52.7,53.34 52.07,53.34 | 52.07,53.34 51.28,53.34 49.44,51.5 COMM_MICRO2.35 | 52.71,52.7 52.71,53.33 52.7,53.34 | IC3.2 57.03,39.96 | 56.36,40.64 53.34,40.64 52.7,40.01 IC1.2 | 57.03,39.96 56.36,40.64 | 57.04,52.68 57.04,52.72 57.66,53.34 | 56.38,53.34 57.66,53.34 | 57.66,53.34 v58.26,53.34 | 57.63,40.64 56.99,40.64 | 56.99,40.64 56.36,40.64 | 57.03,39.96 57.03,40.05 | 57.03,40.05 57.63,40.64 | 57.63,40.64 v59.37,42.39 | 57.03,40.05 57.03,40.6 56.99,40.64
  Bottom 0.152: v58.26,53.34 60.01,51.59 60.01,43.02 v59.37,42.39
MOSI_BUS
  Top 0.152: COMM_MICRO2.23 57.55,24.69 60.25,27.38 88.19,27.38 91.76,30.96 91.76,34.84 JP2.3
MOSI_MEMORY
  Top 0.152: IC4.5 54.01,57.75 53.34,58.42 | 53.34,58.42 52.07,58.42 48.94,55.29 COMM_MICRO2.36 | IC4.5 54.01,57.82 54.61,58.42 | 53.34,58.42 53.98,58.42 | 53.98,58.42 54.61,58.42 | 54.61,58.42 57.78,58.42 58.34,57.86 IC9.5 58.37,57.04 60.64,54.77 60.64,47.32 59.04,45.72 | IC4.5 54.01,58.38 53.98,58.42 | 54,45.06 IC1.5 54,45.11 54.61,45.72 57.63,45.72 | 58.33,45.01 IC3.5 58.33,45.71 58.34,45.72 | 57.63,45.72 58.33,45.01 | 59.04,45.72 58.33,45.01 | 57.63,45.72 58.34,45.72 | 58.34,45.72 59.04,45.72
N$6
  Top 0.508: R3.1 U$3.1
N$10
  Top 0.152: 44.44,19.07 COMM_MICRO2.4 44.44,18.54 43.52,17.62 39.89,17.62 39.27,17 39.27,15.03 Y1.P$4 37.63,13.41 35.9,13.41 33.52,11.03 C33.2
N$11
  Top 0.152: CAN.8 40.43,40.42 R27.2
N$12
  Top 0.61: C37.1 70.62,11.89 75.07,11.89 75.57,12.38 77,12.38 77.46,11.92 IC10.2
N$13
  Top 0.61: IC10.4 80,11.76 78.02,13.74 C37.2
N$16
  Top 0.305: R23.2 57.79,7.99 LED1.2
N$17
  Top 0.305: R34.2 50.36,7.82 LED2.2
N$19
  Top 0.305: R35.2 42.94,7.82 LED3.2
N$20
  Top 0.305: R36.2 33.88,7.82 LED4.2
NRST  (via drill 0.35)
  Top 0.152: C20.2 55.03,10.88 S3.2 48.39,17.53 47.29,17.53 45.94,18.88 COMM_MICRO2.7 45.94,20.77 v43.96,22.74 | v51.25,64.45 51.25,74.18 CODE_UPLOAD.7
  Bottom 0.152: v43.96,22.74 38.17,28.54 38.17,51.37 v51.25,64.45
NSS_BUS
  Top 0.152: COMM_MICRO2.20 58.91,23.19 61.67,25.96 89.46,25.96 97,33.5 97,34.84 JP2.4
OSC_IN  (via drill 0.35)
  Top 0.152: C35.1 44.35,16.31 44.94,16.9 | Y2.3 46.42,16.9 | 45.71,17.61 44.94,18.38 | 44.94,18.38 COMM_MICRO2.5 44.94,20.66 44.44,21.16 42.38,21.16 41.9,20.68 v38.01,20.68 | 44.94,16.9 45.65,17.61 45.71,17.61 | 44.94,18.38 44.94,16.9 | 44.94,16.9 46.42,16.9 | 45.71,17.61 46.42,16.9 | CODE_UPLOAD.9 48.7,75.37 48.1,75.96 46.99,75.96 46.2,75.17 46.2,71.52 46.97,70.75 v46.97,64.45
  Bottom 0.152: v38.01,20.68 35.31,23.38 35.31,52.79 v46.97,64.45
OSC_OUT
  Top 0.152: C36.1 44.31,13.93 44.75,14.36 Y2.1 46.91,13.31 48.33,13.31 48.83,13.81 48.83,16.31 48.08,17.06 46.98,17.06 45.44,18.61 COMM_MICRO2.6
PRESSÃO  (via drill 0.35)
  Top 0.152: v40.01,60.4 40.01,61.28 C8.1 | COMM_MICRO2.10 47.44,21.23 v46.72,21.95
  Top 0.508: R3.2 R4.1 C8.1
  Bottom 0.152: v46.72,21.95 40.85,21.95 40.81,21.91 40.8,21.91 38.73,19.84 37.31,19.84 34.29,22.86 34.29,53.23 40.01,58.94 v40.01,60.4
RXL
  Top 0.305: R20.1 18.59,19.34 RX.A
RXLED
  Top 0.305: U1.22 17.52,17.2 16.58,18.14 15.4,18.14 14.45,19.09 RX.C
SCL1  (via drill 0.35)
  Top 0.152: v43.81,26.04 42.47,24.69 COMM_MICRO2.58 39.36,24.69 38.34,25.72 35.89,25.72 35.59,25.42 v33.68,25.42 | U$2.6 2.66,55.54 v2.86,55.34 | R5.1 64.45,62.23 73.39,62.23 U$6.2
  Bottom 0.152: v33.68,25.42 32.78,25.42 v2.86,55.34 | v43.81,26.04 53.66,35.88 59.69,35.88 64.14,40.32 64.14,49.21 68.58,53.66 74.04,53.66 U$6.2
SCL2  (via drill 0.35)
  Top 0.152: COMM_MICRO2.29 53.27,27.69 54.13,26.83 v55.88,26.83 | R1.1 67.33,35.88 73.24,35.88 U$7.2
  Bottom 0.152: v55.88,26.83 57.31,26.83 57.47,26.99 73.87,26.99 U$7.2
SCL3  (via drill 0.35)
  Top 0.152: COMM_MICRO2.8 46.44,20.81 45.63,21.61 45.63,22.68 v46.19,23.23 | R24.1 v60.96,23.49 v60.96,23.5
  Bottom 0.152: v46.19,23.23 46.29,23.34 54.45,23.34 57.63,26.51 60.17,26.51 | 60.17,26.51 60.96,26.51 | 60.96,26.51 61.76,26.51 | 61.76,26.51 87.31,26.51 91.76,30.96 91.76,37.38 JP2.5 | v60.96,23.5 60.96,25.72 | 60.96,26.51 60.96,25.72 | 60.96,25.72 61.76,26.51 | 60.96,25.72 60.17,26.51
SCLK_BUS
  Top 0.152: COMM_MICRO2.21 58.46,23.69 61.2,26.43 89.06,26.43 95.65,33.02 JP2.2
SCLK_MEMORY  (via drill 0.35)
  Top 0.152: 53.35,43.59 IC1.6 53.35,42.72 | IC9.6 57.69,55.54 57.08,54.93 53.98,54.93 | 53.36,56.33 IC4.6 53.36,54.95 53.34,54.93 | 57.68,43.59 IC3.6 57.68,42.76 57.15,42.23 53.82,42.23 | 52.7,54.93 53.36,55.58 53.98,54.97 53.98,54.93 | 52.7,54.93 51.36,54.93 v50.09,53.66 | 52.7,54.93 53.34,54.93 | 53.34,54.93 53.98,54.93 | 53.82,42.23 53.34,42.23 | 53.34,42.23 52.86,42.23 | 52.86,42.23 50.96,42.23 50.09,41.35 | 53.35,42.72 52.86,42.23 | 53.35,42.69 53.82,42.23 | 53.35,42.72 53.35,42.69 | 53.35,42.69 53.35,42.24 53.34,42.23 | 50.09,41.35 49.94,41.21 COMM_MICRO2.34 | 50.09,41.35 v50.09,51.12
  Bottom 0.152: v50.09,51.12 v50.09,53.66
SDA1  (via drill 0.35)
  Top 0.152: v43.82,25.07 42.94,24.19 COMM_MICRO2.59 39.23,24.19 38.02,25.4 36.35,25.4 35.67,24.72 v32.99,24.72 | v3.49,53.82 3.49,64.2 U$2.1 | v64.77,40.32 64.77,49.85 68.58,53.66 71.5,53.66 U$6.1 71.23,61.85 66.58,61.85 R6.1
  Bottom 0.152: v3.49,53.82 32.59,24.72 v32.99,24.72 | v43.82,25.07 53.99,35.24 59.69,35.24 v64.77,40.32
SDA2  (via drill 0.35)
  Top 0.152: COMM_MICRO2.30 53.41,28.19 54.13,27.46 v56.83,27.46 | R2.1 65.56,31.61 65.56,32.86 68.11,35.4 71.18,35.4 U$7.1
  Bottom 0.152: v56.83,27.46 71.8,27.46 U$7.1
SDA3  (via drill 0.35)
  Top 0.152: COMM_MICRO2.9 46.94,20.81 45.98,21.77 45.98,22.16 46.52,22.7 v47.47,22.7 | R25.1 v60.96,20.48
  Bottom 0.152: v47.47,22.7 48.42,22.7 49.69,21.43 60.01,21.43 | JP2.6 97,37.38 97,33.5 89.54,26.04 67.31,26.04 62.71,21.43 61.91,21.43 | v60.96,20.48 60.96,21.43 | 60.01,21.43 60.96,21.43 | 60.96,21.43 61.91,21.43 | v60.96,20.48 61.91,21.43 | v60.96,20.48 60.01,21.43
SDMMC_CK
  Top 0.152: COMM_MICRO2.53 35.55,27.19 31.41,31.33 MICROSD_CARD.5
SDMMC_CMD  (via drill 0.35)
  Top 0.152: COMM_MICRO2.54 32.77,26.69 v32.77,26.71 | v25.95,33.54 16.93,33.54 MICROSD_CARD.3
  Bottom 0.152: v32.77,26.71 v25.95,33.54
SDMMC_D0
  Top 0.152: MICROSD_CARD.7 16.07,29.13 15.15,30.05 15.15,35.76 16.9,37.51 45.08,37.51 47.44,35.15 COMM_MICRO2.39
SDMMC_D1  (via drill 0.35)
  Top 0.152: COMM_MICRO2.40 46.94,33.5 v46.58,33.86 | v42.3,38.14 16.26,38.14 14.68,36.55 14.68,29.41 16.06,28.03 MICROSD_CARD.8
  Bottom 0.152: v46.58,33.86 v42.3,38.14
SDMMC_D2
  Top 0.152: COMM_MICRO2.51 36.05,28.19 28.52,35.73 MICROSD_CARD.1
SDMMC_D3
  Top 0.152: COMM_MICRO2.52 35.84,27.69 28.91,34.63 MICROSD_CARD.2
SWCLK  (via drill 0.35)
  Top 0.152: COMM_MICRO2.49 41.09,29.23 v41.98,30.13 | CODE_UPLOAD.5 53.7,61.87 v47.33,55.51
  Bottom 0.152: v41.98,30.13 43.85,30.13 47.33,33.6 47.33,34.92 46.7,35.56 46.67,35.56 46.67,52.05 47.33,52.7 v47.33,55.51
SWDIO  (via drill 0.35)
  Top 0.152: COMM_MICRO2.46 43.94,32.18 43.6,32.52 40.62,32.52 v38.96,34.17 | v52.52,64.45 52.52,74.16 CODE_UPLOAD.6
  Bottom 0.152: v52.52,64.45 38.96,50.89 v38.96,34.17
SWO  (via drill 0.35)
  Top 0.152: v39.68,25.85 40.02,26.19 COMM_MICRO2.55 | CODE_UPLOAD.10 47.45,72.44 48.39,71.49 v48.39,64.45
  Bottom 0.152: v39.68,25.85 37.92,24.09 36.66,24.09 36.27,24.49 36.27,52.32 v48.39,64.45
TXL
  Top 0.305: TX.A R19.1
TXLED
  Top 0.305: U1.23 16.88,16.89 16.26,17.5 14.04,17.5 13.25,18.3 13.25,20.77 TX.C
UART1_RX  (via drill 0.35)
  Top 0.152: COMM_MICRO2.43 45.44,33.4 45.25,33.59 v45.25,36.12 | CODE_UPLOAD.3 56.25,74.18 v56.25,67.23
  Bottom 0.152: v56.25,67.23 45.25,56.23 v45.25,36.12
UART1_TX  (via drill 0.35)
  Top 0.152: v46.12,53.2 54.95,62.02 CODE_UPLOAD.4 | v46.01,35.39 45.97,35.39 45.94,35.35 COMM_MICRO2.42
  Bottom 0.152: v46.12,53.2 46.01,53.08 v46.01,35.39
UART2_RX
  Top 0.152: COMM_MICRO2.17 53.66,21.69 54.35,21 58.33,21 59.78,19.55 59.78,4.13 57.9,2.25 19.46,2.25 13.62,8.08 U1.1
UART2_TX
  Top 0.152: COMM_MICRO2.16 53.64,19.84 54.16,20.36 58.17,20.36 59.31,19.23 59.31,4.42 57.63,2.74 21.5,2.74 16.23,8.02 U1.5
USB_D+2
  Top 0.203: X2.D+ 10.3,14.33 11.42,13.21 20.35,13.21 22.07,14.94 U1.15
USB_D-2
  Top 0.203: X2.D- 10.26,15.13 11.56,13.82 20.07,13.82 21.43,15.18 U1.16
UVC  (via drill 0.35)
  Top 0.152: COMM_MICRO2.11 47.94,18.69 v48.38,18.26
  Bottom 0.152: v48.38,18.26 61.6,18.26 73.19,6.67 78.49,6.67 U$8.3
V+
  Top 0.61: 5V.1 90.32,11.27 | 90.32,11.27 82.08,11.27 78.58,14.77 77,14.77 76.19,15.57 IC10.8 76.19,17.33 75.46,18.06 U$8.4 | 90.32,11.27 91.92,11.27 93.03,10.15 3V3.1
V-
  Top 0.61: C38.1 82.69,13.69 IC10.5 80,17.33 80.54,17.86 U$8.6

### Text on the board
tNames: UVA | UVB | Varella Aquisition Module | v.2.0 - 2020 | UVC | C:/Users/marcu/Desktop/zenith-v3.bmp